# Altium project Thunderscope_Rev4.PrjPCB (part 2 of 2)

## Sheet FPGA.SchDoc: ThunderScope 1000E
size A4; DrawnBy: Aleksa Bjelogrlic; Revision: 1
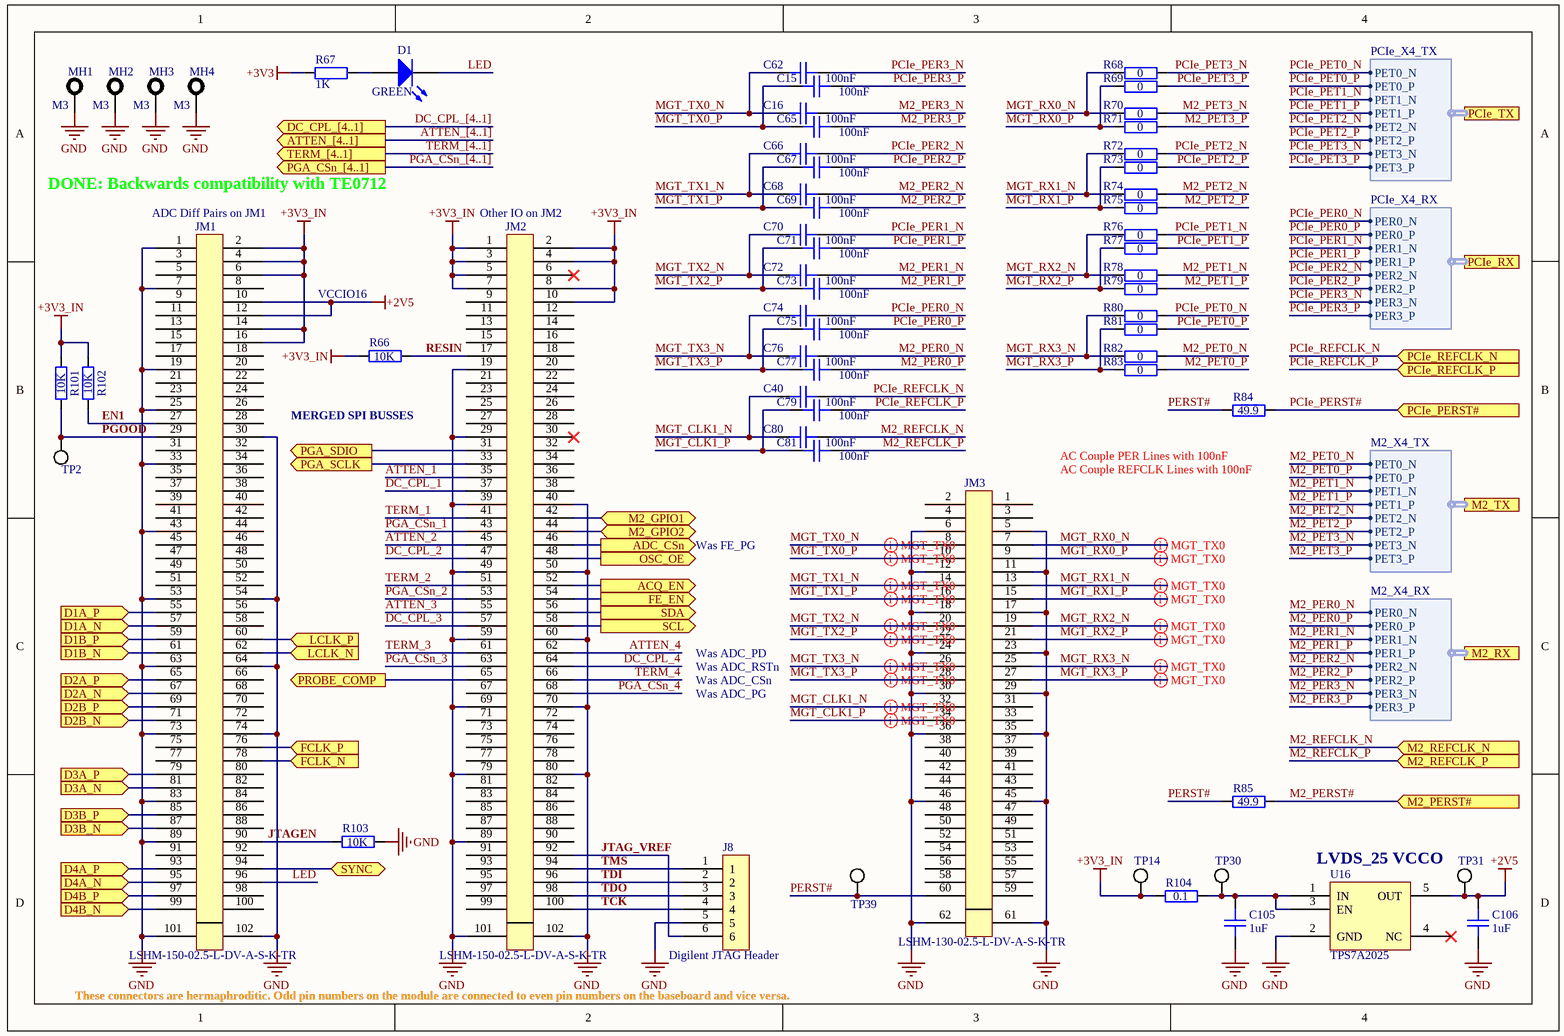
[diagram p5: FPGA.SchDoc]

### Parts
C15  100nF  [GEN_C_0201]
C16  100nF  [GEN_C_0201]
C40  100nF  [GEN_C_0201]
C62  100nF  [GEN_C_0201]
C65  100nF  [GEN_C_0201]
C66  100nF  [GEN_C_0201]
C67  100nF  [GEN_C_0201]
C68  100nF  [GEN_C_0201]
C69  100nF  [GEN_C_0201]
C70  100nF  [GEN_C_0201]
C71  100nF  [GEN_C_0201]
C72  100nF  [GEN_C_0201]
C73  100nF  [GEN_C_0201]
C74  100nF  [GEN_C_0201]
C75  100nF  [GEN_C_0201]
C76  100nF  [GEN_C_0201]
C77  100nF  [GEN_C_0201]
C79  100nF  [GEN_C_0201]
C80  100nF  [GEN_C_0201]
C81  100nF  [GEN_C_0201]
C105  1uF  [GEN_C_0402]
C106  1uF  [GEN_C_0402]
D1  GREEN  [LED_0603_LTST-S270K]
J8  2.54mm 6 Pin TH  [GEN_2.54mm_6_Pin_TH_RA]  (value not drawn)
JM1  LSHM-150-02.5-L-DV-A-S-K-TR  [SAM_LSHM-150-XX.X-XX-DV-A-S]
JM2  LSHM-150-02.5-L-DV-A-S-K-TR  [SAM_LSHM-150-XX.X-XX-DV-A-S]
JM3  LSHM-130-02.5-L-DV-A-S-K-TR  [SAM_LSHM-130-XX.X-XX-DV-A-S]
MH1  M3  [MH M3]  (no BOM)
MH2  M3  [MH M3]  (no BOM)
MH3  M3  [MH M3]  (no BOM)
MH4  M3  [MH M3]  (no BOM)
R66  10K  [GEN_R_0402]
R67  1K  [GEN_R_0402]
R68  0  [GEN_R_0201]
R69  0  [GEN_R_0201]
R70  0  [GEN_R_0201]
R71  0  [GEN_R_0201]
R72  0  [GEN_R_0201]
R73  0  [GEN_R_0201]
R74  0  [GEN_R_0201]
R75  0  [GEN_R_0201]
R76  0  [GEN_R_0201]
R77  0  [GEN_R_0201]
R78  0  [GEN_R_0201]
R79  0  [GEN_R_0201]
R80  0  [GEN_R_0201]
R81  0  [GEN_R_0201]
R82  0  [GEN_R_0201]
R83  0  [GEN_R_0201]
R84  49.9  [GEN_R_0402]
R85  49.9  [GEN_R_0402]
R101  10K  [GEN_R_0402]
R102  10K  [GEN_R_0402]
R103  10K  [GEN_R_0402]
R104  0.1  [GEN_R_0402]
TP2  PCB  [GEN_TP_PCB]  (value not drawn)  (no BOM)
TP14  PCB  [GEN_TP_PCB]  (value not drawn)  (no BOM)
TP30  PCB  [GEN_TP_PCB]  (value not drawn)  (no BOM)
TP31  PCB  [GEN_TP_PCB]  (value not drawn)  (no BOM)
TP39  PCB  [GEN_TP_PCB]  (value not drawn)  (no BOM)
U16  TPS7A2025  [GEN_SOT23_5_950_2900X1600X1450]

### Ports
ACQ_EN (out), ADC_CSn (out), ATTEN_[4..1] (out), D1A_N (in), D1A_P (in), D1B_N (in), D1B_P (in), D2A_N (in), D2A_P (in), D2B_N (in), D2B_P (in), D3A_N (in), D3A_P (in), D3B_N (in), D3B_P (in), D4A_N (in), D4A_P (in), D4B_N (in), D4B_P (in), DC_CPL_[4..1] (out), FCLK_N (in), FCLK_P (in), FE_EN (out), LCLK_N (in), LCLK_P (in), M2_GPIO1 (bidir), M2_GPIO2 (bidir), M2_PERST# (in), M2_REFCLK_N (in), M2_REFCLK_P (in), M2_RX (harness M2_X4_RX), M2_TX (harness M2_X4_TX), OSC_OE (out), PCIe_PERST# (in), PCIe_REFCLK_N (in), PCIe_REFCLK_P (in), PCIe_RX (harness PCIe_X4_RX), PCIe_TX (harness PCIe_X4_TX), PGA_CSn_[4..1] (out), PGA_SCLK (out), PGA_SDIO (out), PROBE_COMP (out), SCL (out), SDA (out), SYNC (bidir), TERM_[4..1] (out)

### Harnesses
PCIe_X4_RX: PER0_N, PER0_P, PER1_N, PER1_P, PER2_N, PER2_P, PER3_N, PER3_P
PCIe_X4_TX: PET0_N, PET0_P, PET1_N, PET1_P, PET2_N, PET2_P, PET3_N, PET3_P
M2_X4_RX: PER0_N, PER0_P, PER1_N, PER1_P, PER2_N, PER2_P, PER3_N, PER3_P
M2_X4_TX: PET0_N, PET0_P, PET1_N, PET1_P, PET2_N, PET2_P, PET3_N, PET3_P

### Nets
+2V5: C106.2 JM1.10 JM1.12 TP31.1 U16.5(OUT)
+3V3: R67.2
+3V3_IN: JM1.2 JM1.4 JM1.6 JM1.14 JM1.16 JM2.1 JM2.2 JM2.3 JM2.4 JM2.5 JM2.7 JM2.8 JM2.10 R66.2 R101.2 R102.2 R104.1 TP14.1
GND: C105.1 C106.1 J8.5 JM1.1 JM1.7 JM1.19 JM1.25 JM1.30 JM1.33 JM1.43 JM1.53 JM1.54 JM1.63 JM1.64 JM1.73 JM1.74 JM1.83 JM1.89 JM1.101 JM1.102 JM2.19 JM2.29 JM2.39 JM2.40 JM2.49 JM2.50 JM2.59 JM2.60 JM2.69 JM2.70 JM2.79 JM2.80 JM2.89 JM2.101 JM2.102 JM3.5 JM3.6 JM3.11 JM3.12 JM3.17 JM3.18 JM3.23 JM3.24 JM3.29 JM3.30 JM3.35 JM3.36 JM3.45 JM3.46 JM3.61 JM3.62 MH1.1 MH2.1 MH3.1 MH4.1 R103.1 U16.2(GND)
ACQ_EN: JM2.52 ; port ACQ_EN
ADC_CSn: JM2.46 ; port ADC_CSn
ADC_SCLK: JM2.33 ; port PGA_SCLK
ADC_SDATA: JM2.31 ; port PGA_SDIO
ATTEN_1: JM2.35
ATTEN_2: JM2.45
ATTEN_3: JM2.55
ATTEN_4: JM2.62
D1A_N: JM1.57 ; port D1A_N
D1A_P: JM1.55 ; port D1A_P
D1B_N: JM1.61 ; port D1B_N
D1B_P: JM1.59 ; port D1B_P
D2A_N: JM1.67 ; port D2A_N
D2A_P: JM1.65 ; port D2A_P
D2B_N: JM1.71 ; port D2B_N
D2B_P: JM1.69 ; port D2B_P
D3A_N: JM1.81 ; port D3A_N
D3A_P: JM1.79 ; port D3A_P
D3B_N: JM1.87 ; port D3B_N
D3B_P: JM1.85 ; port D3B_P
D4A_N: JM1.95 ; port D4A_N
D4A_P: JM1.93 ; port D4A_P
D4B_N: JM1.99 ; port D4B_N
D4B_P: JM1.97 ; port D4B_P
DC_CPL_1: JM2.37
DC_CPL_2: JM2.47
DC_CPL_3: JM2.57
DC_CPL_4: JM2.64
EN1: JM1.27 R102.1
FCLK_N: JM1.78 ; port FCLK_N
FCLK_P: JM1.76 ; port FCLK_P
FE_EN: JM2.54 ; port FE_EN
JTAG_VREF: J8.6 JM2.92
JTAGEN: JM1.90 R103.2
LCLK_N: JM1.62 ; port LCLK_N
LCLK_P: JM1.60 ; port LCLK_P
LED: D1.1(K) JM1.96
M2_GPIO1: JM2.42 ; port M2_GPIO1
M2_GPIO2: JM2.44 ; port M2_GPIO2
M2_PER0_N: C76.1 ; port M2_RX.PER0_N
M2_PER0_P: C77.1 ; port M2_RX.PER0_P
M2_PER1_N: C72.1 ; port M2_RX.PER1_N
M2_PER1_P: C73.1 ; port M2_RX.PER1_P
M2_PER2_N: C68.1 ; port M2_RX.PER2_N
M2_PER2_P: C69.1 ; port M2_RX.PER2_P
M2_PER3_N: C16.1 ; port M2_RX.PER3_N
M2_PER3_P: C65.1 ; port M2_RX.PER3_P
M2_PERST#: R85.2 ; port M2_PERST#
M2_PET0_N: R82.2 ; port M2_TX.PET0_N
M2_PET0_P: R83.2 ; port M2_TX.PET0_P
M2_PET1_N: R78.2 ; port M2_TX.PET1_N
M2_PET1_P: R79.2 ; port M2_TX.PET1_P
M2_PET2_N: R74.2 ; port M2_TX.PET2_N
M2_PET2_P: R75.2 ; port M2_TX.PET2_P
M2_PET3_N: R70.2 ; port M2_TX.PET3_N
M2_PET3_P: R71.2 ; port M2_TX.PET3_P
M2_REFCLK_N: C80.1 ; port M2_REFCLK_N
M2_REFCLK_P: C81.1 ; port M2_REFCLK_P
MGT_CLK1_N: C40.2 C80.2 JM3.32
MGT_CLK1_P: C79.2 C81.2 JM3.34
MGT_RX0_N: JM3.7 R68.1 R70.1
MGT_RX0_P: JM3.9 R69.1 R71.1
MGT_RX1_N: JM3.13 R72.1 R74.1
MGT_RX1_P: JM3.15 R73.1 R75.1
MGT_RX2_N: JM3.19 R76.1 R78.1
MGT_RX2_P: JM3.21 R77.1 R79.1
MGT_RX3_N: JM3.25 R80.1 R82.1
MGT_RX3_P: JM3.27 R81.1 R83.1
MGT_TX0_N: C16.2 C62.2 JM3.8
MGT_TX0_P: C15.2 C65.2 JM3.10
MGT_TX1_N: C66.2 C68.2 JM3.14
MGT_TX1_P: C67.2 C69.2 JM3.16
MGT_TX2_N: C70.2 C72.2 JM3.20
MGT_TX2_P: C71.2 C73.2 JM3.22
MGT_TX3_N: C74.2 C76.2 JM3.26
MGT_TX3_P: C75.2 C77.2 JM3.28
PCIe_PER0_N: C74.1 ; port PCIe_RX.PER0_N
PCIe_PER0_P: C75.1 ; port PCIe_RX.PER0_P
PCIe_PER1_N: C70.1 ; port PCIe_RX.PER1_N
PCIe_PER1_P: C71.1 ; port PCIe_RX.PER1_P
PCIe_PER2_N: C66.1 ; port PCIe_RX.PER2_N
PCIe_PER2_P: C67.1 ; port PCIe_RX.PER2_P
PCIe_PER3_N: C62.1 ; port PCIe_RX.PER3_N
PCIe_PER3_P: C15.1 ; port PCIe_RX.PER3_P
PCIe_PERST#: R84.2 ; port PCIe_PERST#
PCIe_PET0_N: R80.2 ; port PCIe_TX.PET0_N
PCIe_PET0_P: R81.2 ; port PCIe_TX.PET0_P
PCIe_PET1_N: R76.2 ; port PCIe_TX.PET1_N
PCIe_PET1_P: R77.2 ; port PCIe_TX.PET1_P
PCIe_PET2_N: R72.2 ; port PCIe_TX.PET2_N
PCIe_PET2_P: R73.2 ; port PCIe_TX.PET2_P
PCIe_PET3_N: R68.2 ; port PCIe_TX.PET3_N
PCIe_PET3_P: R69.2 ; port PCIe_TX.PET3_P
PCIe_REFCLK_N: C40.1 ; port PCIe_REFCLK_N
PCIe_REFCLK_P: C79.1 ; port PCIe_REFCLK_P
PERST#: JM3.60 R84.1 R85.1 TP39.1
PGA_CSn_1: JM2.43
PGA_CSn_2: JM2.53
PGA_CSn_3: JM2.63
PGA_CSn_4: JM2.68
PGOOD: JM1.29 R101.1 TP2.1
PLL_RSTn: JM2.48 ; port OSC_OE
PROBE_COMP: JM2.65 ; port PROBE_COMP
RESIN: JM2.17 R66.1
SCL: JM2.58 ; port SCL
SDA: JM2.56 ; port SDA
SYNC: JM1.94 ; port SYNC
TCK: J8.4 JM2.100
TDI: J8.2 JM2.96
TDO: J8.3 JM2.98
TERM_1: JM2.41
TERM_2: JM2.51
TERM_3: JM2.61
TERM_4: JM2.66
TMS: J8.1 JM2.94
NetC105_2: C105.2 R104.2 TP30.1 U16.1(IN) U16.3(EN)
NetD1_2: D1.2(A) R67.1

Not connected (* = marked no-connect by the designer): JM1 3 5 8 9 11 13 15 17 18 20 21 22 23 24 26 28 31 32 34 35 36 37 38 39 40 41 42 44 45 46 47 48 49 50 51 52 56 58 66 68 70 72 75 77 80 82 84 86 88 91 92 98 100; JM2 6* 9 11 12 13 14 15 16 18 20 21 22 23 24 25 26 27 28 30* 32 34 36 38 67 71 72 73 74 75 76 77 78 81 82 83 84 85 86 87 88 90 91 93 95 97 99; JM3 1 2 3 4 31 33 37 38 39 40 41 42 43 44 47 48 49 50 51 52 53 54 55 56 57 58 59; U16 4(NC)*

### Buses and harness runs
bus ATTEN_[4..1] = port ATTEN_[4..1]
bus DC_CPL_[4..1] = port DC_CPL_[4..1]
bus PGA_CSn_[4..1] = port PGA_CSn_[4..1]
bus TERM_[4..1] = port TERM_[4..1]

### Layout directives
differential pair; differential pair class PCIe: MGT_CLK1_N, MGT_CLK1_P, MGT_RX0_N, MGT_RX0_P, MGT_RX1_N, MGT_RX1_P, MGT_RX2_N, MGT_RX2_P, MGT_RX3_N, MGT_RX3_P, MGT_TX0_N, MGT_TX0_P, MGT_TX1_N, MGT_TX1_P, MGT_TX2_N, MGT_TX2_P, MGT_TX3_N, MGT_TX3_P

### Notes on the sheet
- DONE: Backwards compatibility with TE0712
- (near JM1) ADC Diff Pairs on JM1
- (near JM2) Other IO on JM2
- VCCIO16
- MERGED SPI BUSSES
- (near R84) AC Couple PER Lines with 100nF
- AC Couple REFCLK Lines with 100nF
- Was FE_PG
- Was ADC_PD
- Was ADC_RSTn
- Was ADC_PG
- Was ADC_CSn
- (near U16) LVDS_25 VCCO
- (near J8) Digilent JTAG Header
- These connectors are hermaphroditic. Odd pin numbers on the module are connected to even pin numbers on the baseboard and vice versa.

### Library data of the parts
C15 C16 C40 C62 C65-C77 C79-C81 = CAP 100nF 6.3V X5R 0201: Voltage Rating: 6.3V; Package: 0201; Supplier 1: Digi-Key; Supplier Part Number 1: 490-3167-1-ND; Value: 100nF
C105 C106 = CAP 1uF 25V X5R 0402: Voltage Rating: 25V; Package: 0402; Supplier 1: Digi-Key; Supplier Part Number 1: 490-10017-1-ND; Value: 1uF
D1 = LED GREEN 0603 LTST-S270K: Supplier 1: Digi-Key; Supplier Part Number 1: 160-1478-1-ND
J8 = CONN 2.54mm 6 Pin TH RA: Supplier 1: Digi-Key; Supplier Part Number 1: 732-5339-ND
JM1 JM2 = CONN LSHM-150-02.5-L-DV-A-S-K-TR: Manufacturer: Samtec; Supplier 1: Digi-Key; Supplier Part Number 1: SAM14147DKR-ND; House Part Number: LSHM-150-02.5-L-DV-A-S-K-TR; Manufacturer Part Number: LSHM-150-02.5-L-DV-A-S-K-TR
JM3 = CONN LSHM-130-02.5-L-DV-A-S-K-TR: Manufacturer: Samtec; Supplier 1: Digi-Key; Supplier Part Number 1: SAM14106DKR-ND; House Part Number: LSHM-130-02.5-L-DV-A-S-K-TR; Manufacturer Part Number: LSHM-130-02.5-L-DV-A-S-K-TR
MH1-MH4 = MH M3
R66 R101-R103 = RES 10K OHM 1% 1/10W 0402: Tolerance: 1%; Power Rating: 0.1W; Package: 0402; Supplier 1: Digi-Key; Supplier Part Number 1: P10.0KLCT-ND; Value: 10K
R67 = RES 1K OHM 1% 1/10W 0402: Tolerance: 1%; Power Rating: 0.1W; Package: 0402; Supplier 1: Digi-Key; Supplier Part Number 1: 311-1.00KLRCT-ND; Value: 1K
R68-R83 = RES 0 OHM 1% 1/20W 0201: Power Rating: 0.05W; Tolerance: 1%; Package: 0201; Supplier 1: Digi-Key; Supplier Part Number 1: RMCF0201ZT0R00CT-ND; Value: 0
R84 R85 = RES 49.9 OHM 1% 1/10W 0402: Tolerance: 1%; Power Rating: 0.1W; Package: 0402; Supplier 1: Digi-Key; Supplier Part Number 1: 311-49.9LRCT-ND; Value: 49.9
R104 = RES 0.1 OHM 1% 1/6W 0402: Tolerance: 1%; Power Rating: 0.16W; Package: 0402; Supplier 1: Digi-Key; Supplier Part Number 1: P.10AKCT-ND; Value: 0.1
TP2 TP14 TP30 TP31 TP39 = TP PCB 1mm
U16 = IC LDO TPS7A2025: Supplier 1: Digi-Key; Supplier Part Number 1: 296-TPS7A2025PDBVRCT-ND

## Sheet CON_PCIe_X4.SchDoc: ThunderScope 1000E
size A4; DrawnBy: Aleksa Bjelogrlic; Revision: 1
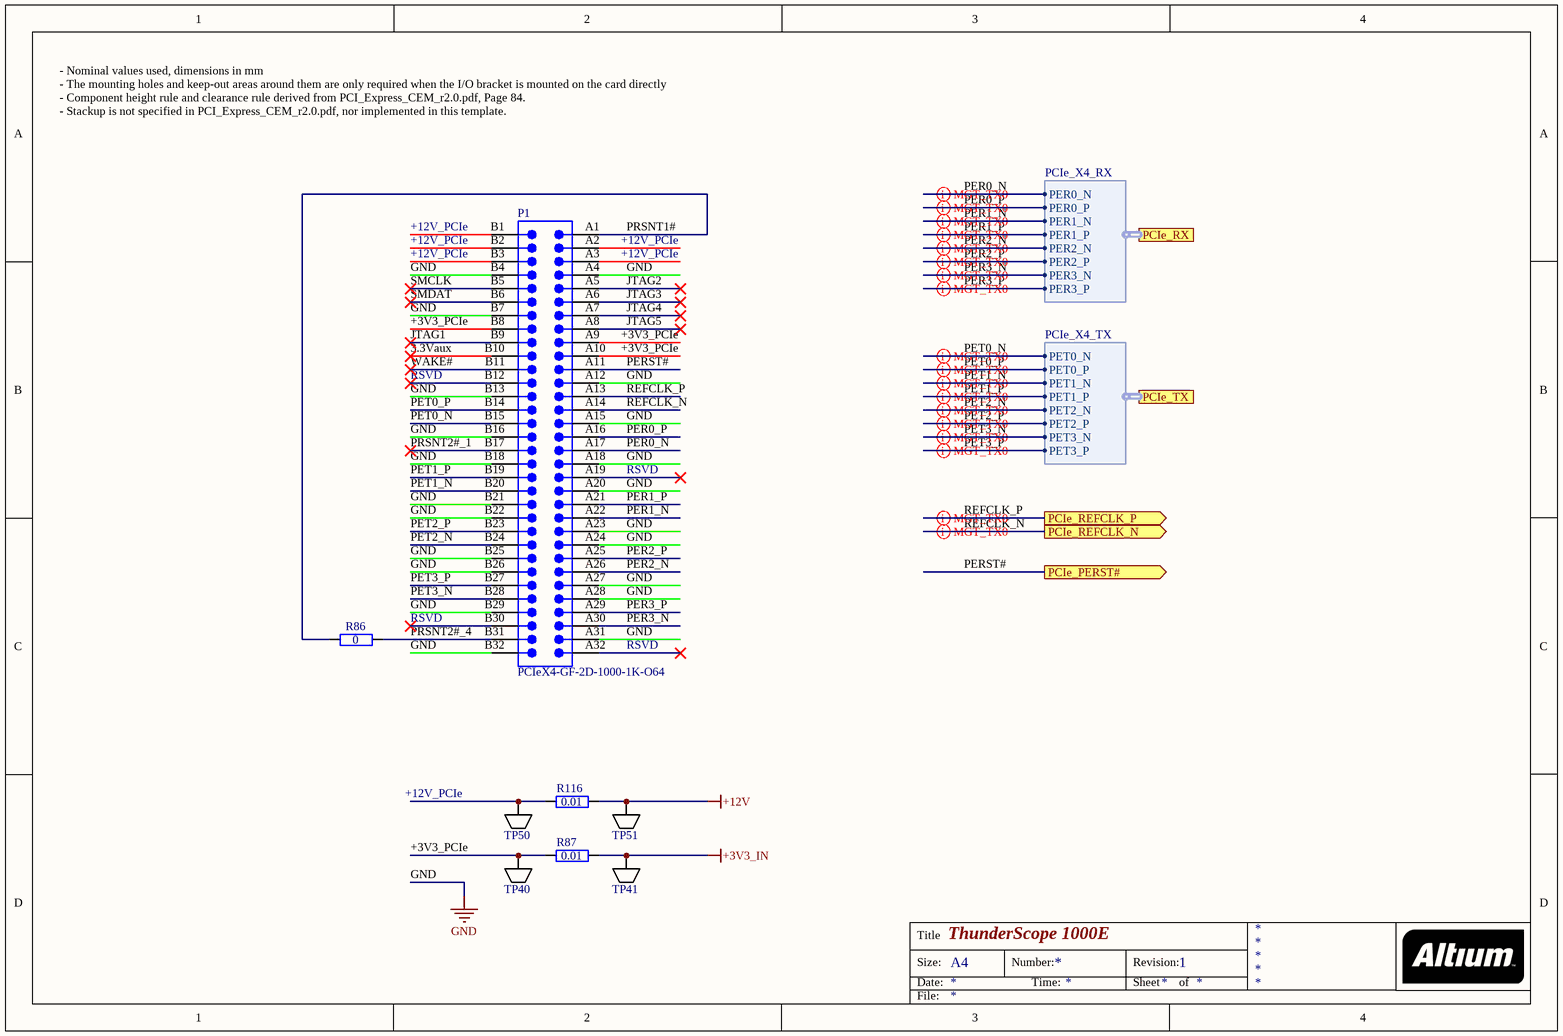
[diagram p6: CON_PCIe_X4.SchDoc]

### Parts
P1  PCIeX4-GF-2D-1000-1K-O64  [PCIeX4-GF-2D-1000-1K-O64]  (no BOM)
R86  0  [GEN_R_0402]
R87  0.01  [GEN_R_0603]
R116  0.01  [GEN_R_0603]
TP40  5015  [KEY_5015]  (value not drawn)
TP41  5015  [KEY_5015]  (value not drawn)
TP50  5015  [KEY_5015]  (value not drawn)
TP51  5015  [KEY_5015]  (value not drawn)

### Ports
PCIe_PERST# (out), PCIe_REFCLK_N (out), PCIe_REFCLK_P (out), PCIe_RX (harness PCIe_X4_RX), PCIe_TX (harness PCIe_X4_TX)

### Harnesses
PCIe_X4_RX: PER0_N, PER0_P, PER1_N, PER1_P, PER2_N, PER2_P, PER3_N, PER3_P
PCIe_X4_TX: PET0_N, PET0_P, PET1_N, PET1_P, PET2_N, PET2_P, PET3_N, PET3_P

### Nets
+3V3_IN: R87.2 TP41.1
+12V: R116.2 TP51.1
GND: P1.A4 P1.A12 P1.A15 P1.A18 P1.A20 P1.A23 P1.A24 P1.A27 P1.A28 P1.A31 P1.B4 P1.B7 P1.B13 P1.B16 P1.B18 P1.B21 P1.B22 P1.B25 P1.B26 P1.B29 P1.B32
3.3Vaux: P1.B10
+3V3_PCIe: P1.A9 P1.A10 P1.B8 R87.1 TP40.1
+12V_PCIe: P1.A2 P1.A3 P1.B1 P1.B2 P1.B3 R116.1 TP50.1
JTAG1: P1.B9
JTAG2: P1.A5
JTAG3: P1.A6
JTAG4: P1.A7
JTAG5: P1.A8
PER0_N: P1.A17 ; port PCIe_RX.PER0_N  [project net PCIe_PER0_N]
PER0_P: P1.A16 ; port PCIe_RX.PER0_P  [project net PCIe_PER0_P]
PER1_N: P1.A22 ; port PCIe_RX.PER1_N  [project net PCIe_PER1_N]
PER1_P: P1.A21 ; port PCIe_RX.PER1_P  [project net PCIe_PER1_P]
PER2_N: P1.A26 ; port PCIe_RX.PER2_N  [project net PCIe_PER2_N]
PER2_P: P1.A25 ; port PCIe_RX.PER2_P  [project net PCIe_PER2_P]
PER3_N: P1.A30 ; port PCIe_RX.PER3_N  [project net PCIe_PER3_N]
PER3_P: P1.A29 ; port PCIe_RX.PER3_P  [project net PCIe_PER3_P]
PERST#: P1.A11 ; port PCIe_PERST#  [project net PCIe_PERST#]
PET0_N: P1.B15 ; port PCIe_TX.PET0_N  [project net PCIe_PET0_N]
PET0_P: P1.B14 ; port PCIe_TX.PET0_P  [project net PCIe_PET0_P]
PET1_N: P1.B20 ; port PCIe_TX.PET1_N  [project net PCIe_PET1_N]
PET1_P: P1.B19 ; port PCIe_TX.PET1_P  [project net PCIe_PET1_P]
PET2_N: P1.B24 ; port PCIe_TX.PET2_N  [project net PCIe_PET2_N]
PET2_P: P1.B23 ; port PCIe_TX.PET2_P  [project net PCIe_PET2_P]
PET3_N: P1.B28 ; port PCIe_TX.PET3_N  [project net PCIe_PET3_N]
PET3_P: P1.B27 ; port PCIe_TX.PET3_P  [project net PCIe_PET3_P]
PRSNT1#: P1.A1 R86.1
PRSNT2#_1: P1.B17
PRSNT2#_4: P1.B31 R86.2
REFCLK_N: P1.A14 ; port PCIe_REFCLK_N  [project net PCIe_REFCLK_N]
REFCLK_P: P1.A13 ; port PCIe_REFCLK_P  [project net PCIe_REFCLK_P]
SMCLK: P1.B5
SMDAT: P1.B6
WAKE#: P1.B11

Not connected (* = marked no-connect by the designer): P1 A19* A32* B12* B30*

### Layout directives
differential pair; differential pair class PCIe: PCIe_PER0_N, PCIe_PER0_P, PCIe_PER1_N, PCIe_PER1_P, PCIe_PER2_N, PCIe_PER2_P, PCIe_PER3_N, PCIe_PER3_P, PCIe_PET0_N, PCIe_PET0_P, PCIe_PET1_N, PCIe_PET1_P, PCIe_PET2_N, PCIe_PET2_P, PCIe_PET3_N, PCIe_PET3_P, PCIe_REFCLK_N, PCIe_REFCLK_P

### Notes on the sheet
- - Nominal values used, dimensions in mm
  - The mounting holes and keep-out areas around them are only required when the I/O bracket is mounted on the card directly
  - Component height rule and clearance rule derived from PCI_Express_CEM_r2.0.pdf, Page 84.
  - Stackup is not specified in PCI_Express_CEM_r2.0.pdf, nor implemented in this template.
- RSVD
- (near R86) RSVD
- Title
- Size:
- Date:
- A4
- Number:
- Time:
- Revision:
- Sheet
- of
- File:

### Library data of the parts
P1 = CMP-0001-00031-2: Golden finger, PCIeX4, Dual, Opposite, Pitch 1mm, 64-Position; Mating Connector: Molex-87715-9106; Datasheet Version: rev2.0, Apr-2007; Package Reference: PCIeX4-GF-2D-1000-1K-O64; ClassName: Edge Connector; Publisher: Altium
R86 = RES 0 OHM 1/16W 0402: Power Rating: 0.0625W; Package: 0402; Supplier 1: Digi-Key; Supplier Part Number 1: 311-0.0JRCT-ND; Value: 0
R87 R116 = RES 0.01 OHM 1% 1/4W 0603: Tolerance: 1%; Power Rating: 0.25W; Supplier 1: Digi-Key; Supplier Part Number 1: 408-1404-1-ND; Value: 0.01; Package: 0603
TP40 TP41 TP50 TP51 = TP KEYSTONE 5015: Supplier 1: Digi-Key; Supplier Part Number 1: 36-5015CT-ND

## Sheet PWR.SchDoc: ThunderScope 1000E
size A4
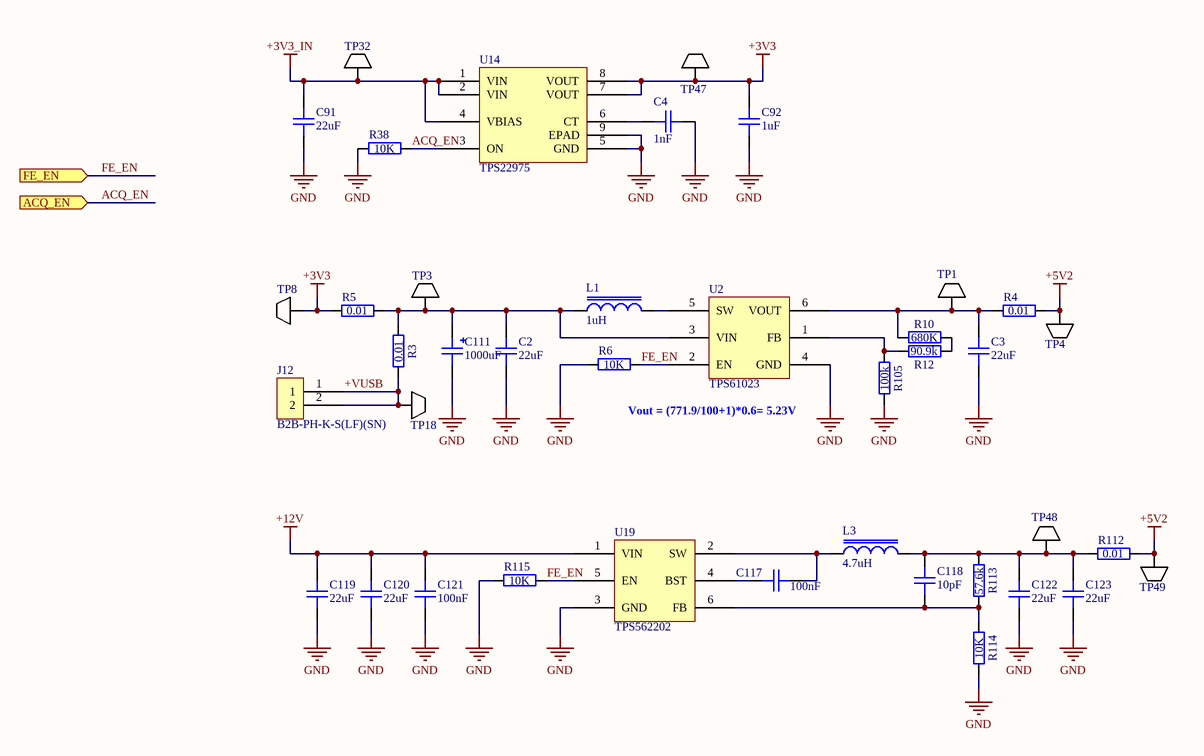
[diagram p7: PWR.SchDoc]

### Parts
C2  22uF  [GEN_C_0805]
C3  22uF  [GEN_C_0805]
C4  1nF  [GEN_C_0402]
C91  22uF  [GEN_C_0805]
C92  1uF  [GEN_C_0402]
C111  1000uF  [GEN_C_POLAR_10mm]
C117  100nF  [GEN_C_0402]
C118  10pF  [GEN_C_0402]
C119  22uF  [GEN_C_0805]
C120  22uF  [GEN_C_0805]
C121  100nF  [GEN_C_0402]
C122  22uF  [GEN_C_0805]
C123  22uF  [GEN_C_0805]
J12  B2B-PH-K-S(LF)(SN)  [JST_B2B-PH-K-S(LF)(SN)]
L1  1uH  [GEN_L_1210]
L3  4.7uH  [TY_IND_NRS5030]
R3  0.01  [GEN_R_0603]
R4  0.01  [GEN_R_0603]
R5  0.01  [GEN_R_0603]
R6  10K  [GEN_R_0402]
R10  680K  [GEN_R_0402]
R12  90.9k  [GEN_R_0402]
R38  10K  [GEN_R_0402]
R105  100k  [GEN_R_0402]
R112  0.01  [GEN_R_0603]
R113  57.6k  [GEN_R_0402]
R114  10K  [GEN_R_0402]
R115  10K  [GEN_R_0402]
TP1  5015  [KEY_5015]  (value not drawn)
TP3  5015  [KEY_5015]  (value not drawn)
TP4  5015  [KEY_5015]  (value not drawn)
TP8  5015  [KEY_5015]  (value not drawn)
TP18  5015  [KEY_5015]  (value not drawn)
TP32  5015  [KEY_5015]  (value not drawn)
TP47  5015  [KEY_5015]  (value not drawn)
TP48  5015  [KEY_5015]  (value not drawn)
TP49  5015  [KEY_5015]  (value not drawn)
U2  TPS61023  [TI_SOT563_DRL0006A]
U14  TPS22975  [TI_WSON8_DSG0008A]
U19  TPS562202  [TI_SOT563_DRL0006A]

### Ports
ACQ_EN (in), FE_EN (in)

### Nets
+3V3: C92.2 R5.2 TP8.1 TP47.1 U14.7(VOUT) U14.8(VOUT)
+3V3_IN: C91.2 TP32.1 U14.1(VIN) U14.2(VIN) U14.4(VBIAS)
+5V2: R4.2 R112.2 TP4.1 TP49.1
+12V: C119.2 C120.2 C121.1 U19.1(VIN)
GND: C2.1 C3.1 C4.1 C91.1 C92.1 C111.2 C119.1 C120.1 C121.2 C122.1 C123.1 R6.2 R38.1 R105.1 R114.1 R115.2 U2.4(GND) U14.5(GND) U14.9(EPAD) U19.3(GND)
+VUSB: J12.1 J12.2 R3.2 TP18.1
ACQ_EN: R38.2 U14.3(ON) ; port ACQ_EN
FE_EN: R6.1 R115.1 U2.2(EN) U19.5(EN) ; port FE_EN
NetC2_2: C2.2 C111.1 L1.1 R3.1 R5.1 TP3.1 U2.3(VIN)
NetC3_2: C3.2 R4.1 R10.2 TP1.1 U2.6(VOUT)
NetC4_2: C4.2 U14.6(CT)
NetC117_1: C117.1 L3.1 U19.2(SW)
NetC117_2: C117.2 U19.4(BST)
NetC118_1: C118.1 R113.1 R114.2 U19.6(FB)
NetC118_2: C118.2 C122.2 C123.2 L3.2 R112.1 R113.2 TP48.1
NetL1_2: L1.2 U2.5(SW)
NetR10_1: R10.1 R12.2
NetR12_1: R12.1 R105.2 U2.1(FB)

### Notes on the sheet
- Vout = (771.9/100+1)*0.6= 5.23V

### Library data of the parts
C2 C3 C91 C119 C120 C122 C123 = CAP 22uF 25V X5R 0805: Voltage Rating: 25V; Package: 0805; Value: 22uF; Supplier 1: Digi-Key; Supplier Part Number 1: 490-10749-1-ND
C4 = CAP 1nF 50V C0G 0402: Voltage Rating: 50V; Package: 0402; Supplier 1: Digi-Key; Supplier Part Number 1: 490-6189-1-ND; Value: 1nF
C92 = CAP 1uF 25V X5R 0402: Voltage Rating: 25V; Package: 0402; Value: 1uF; Supplier 1: Digi-Key; Supplier Part Number 1: 490-10017-1-ND
C111 = CAP 1000uF 16V 10mm Dia: Voltage Rating: 16V; Package: 10mm; Value: 1000uF; Supplier 1: Digi-Key; Supplier Part Number 1: P124991CT-ND
C117 C121 = CAP 100nF 16V X7R 0402: Voltage Rating: 16V; Package: 0402; Supplier 1: Digi-Key; Supplier Part Number 1: 490-4759-1-ND; Value: 100nF
C118 = CAP 10pF 50V C0G 0402: Temperature Coefficient: C0G; Voltage Rating: 50V; Package: 0402; Value: 10pF; Supplier 1: Digi-Key; Supplier Part Number 1: 1276-1139-1-ND
J12 = CONN JST PH 2 Pin TH: Supplier 1: Digi-Key; Supplier Part Number 1: 455-1704-ND
L1 = IND 1uH 3.1A 45 MOHM 1210: Value: 1uH; Supplier 1: Digi-Key; Supplier Part Number 1: 490-10590-1-ND
L3 = IND 4.7uH 2.6A 35 MOHM SMD: Value: 4.7uH; Supplier 1: Digi-Key; Supplier Part Number 1: 587-3461-1-ND
R3-R5 R112 = RES 0.01 OHM 1% 1/4W 0603: Tolerance: 1%; Power Rating: 0.25W; Supplier 1: Digi-Key; Supplier Part Number 1: 408-1404-1-ND; Value: 0.01; Package: 0603
R6 R38 R114 R115 = RES 10K OHM 1% 1/10W 0402: Tolerance: 1%; Power Rating: 0.1W; Package: 0402; Supplier 1: Digi-Key; Supplier Part Number 1: P10.0KLCT-ND; Value: 10K
R10 = RES 680K OHM 1% 1/16W 0402: Manufacturer: Yageo; Manufacturer Part Number: RC0402FR-07681KL; Tolerance: 1%; Package: 0402; Supplier 1: Digi-Key; Supplier Part Number 1: YAG3211CT-ND; Value: 680K
R12 = RES 90.9K OHM 1% 1/16W 0402: Tolerance: 1%; Power Rating: 0.0625W; Package: 0402; Supplier 1: Digi-Key; Supplier Part Number 1: 311-90.9KLRCT-ND; Value: 90.9k
R105 = RES 100K OHM 1% 1/10W 0402: Tolerance: 1%; Power Rating: 0.1W; Package: 0402; Supplier 1: Digi-Key; Supplier Part Number 1: 311-100KLRCT-ND; Value: 100k
R113 = RES 57.6K OHM 1% 1/16W 0402: Tolerance: 1%; Power Rating: 0.0625W; Package: 0402; Value: 57.6k; Supplier 1: Digi-Key; Supplier Part Number 1: YAG3190CT-ND
TP1 TP3 TP4 TP8 TP18 TP32 TP47-TP49 = TP KEYSTONE 5015: Supplier 1: Digi-Key; Supplier Part Number 1: 36-5015CT-ND
U2 = IC BOOST TPS61023: Supplier 1: Digi-Key; Supplier Part Number 1: 296-TPS61023DRLTCT-ND
U14 = IC SWITCH LOAD TPS22975: Supplier 1: Digi-Key; Supplier Part Number 1: 296-47228-1-ND
U19 = IC BUCK TPS562202: Supplier 1: Digi-Key; Supplier Part Number 1: 296-TPS562202DRLRCT-ND

## Nets that join several sheets
+1V8APLL: ADC (FB3.2), PLL (21 pins)
+3V3: Main (C1.1 R110.1 U1.5), FE (Q1.2 Q2.2 R20.2 R21.2), Front End/CH1 (D1000A.1 D1001A.1 K1000A.1 K1001A.1), Front End/CH2 (D1000B.1 D1001B.1 K1000B.1 K1001B.1), Front End/CH3 (D1000C.1 D1001C.1 K1000C.1 K1001C.1), Front End/CH4 (D1000D.1 D1001D.1 K1000D.1 K1001D.1), ADC (9 pins), PLL (FB5.1 R89.2 R90.2 R91.2), FPGA (R67.2), PWR (6 pins)
+3V3_IN: FPGA (18 pins), CON_PCIe_X4 (R87.2 TP41.1), PWR (5 pins)
+3V3_PGA: FE (C126.2 TP53.1 U20.5), Front End/CH1 (C26A.2 R29A.2 U7A.12), Front End/CH2 (C26B.2 R29B.2 U7B.12), Front End/CH3 (C26C.2 R29C.2 U7C.12), Front End/CH4 (C26D.2 R29D.2 U7D.12)
+5V: FE (18 pins), Front End/CH1 (19 pins), Front End/CH2 (19 pins), Front End/CH3 (19 pins), Front End/CH4 (19 pins)
+5V2: FE (R7.1 R8.1 TP13.1), PWR (R4.2 R112.2 TP4.1 TP49.1)
+12V: CON_PCIe_X4 (R116.2 TP51.1), PWR (C119.2 C120.2 C121.1 U19.1)
+VBIAS: FE (TP17.1 U8.2 U8.6), Front End/CH1 (R97A.2 R98A.1), Front End/CH2 (R97B.2 R98B.1), Front End/CH3 (R97C.2 R98C.1), Front End/CH4 (R97D.2 R98D.1)
-5V: FE (7 pins), Front End/CH1 (14 pins), Front End/CH2 (14 pins), Front End/CH3 (14 pins), Front End/CH4 (14 pins)
-VBIAS: FE (TP19.1 U5.2 U5.6), Front End/CH1 (C1030A.1 R1051A.1), Front End/CH2 (C1030B.1 R1051B.1), Front End/CH3 (C1030C.1 R1051C.1), Front End/CH4 (C1030D.1 R1051D.1)
GND: Main (20 pins), FE (29 pins), Front End/CH1 (47 pins), Front End/CH2 (47 pins), Front End/CH3 (47 pins), Front End/CH4 (47 pins), ADC (34 pins), PLL (27 pins), FPGA (57 pins), CON_PCIe_X4 (21 pins), PWR (20 pins)
ACQ_EN: Main (TP33.1), FPGA (JM2.52), PWR (R38.2 U14.3)
ADC_CLK_N: ADC (C104.2 J5.1), PLL (U15.48)
ADC_CLK_P: ADC (C103.2 J6.1), PLL (U15.47)
ADC_CSn: ADC (R42.1 TP29.1 U12.2), FPGA (JM2.46)
ADC_SCLK: Front End/CH1 (U7A.11), Front End/CH2 (U7B.11), Front End/CH3 (U7C.11), Front End/CH4 (U7D.11), ADC (TP35.1 U12.4), FPGA (JM2.33)
ADC_SDATA: Front End/CH1 (U7A.10), Front End/CH2 (U7B.10), Front End/CH3 (U7C.10), Front End/CH4 (U7D.10), ADC (TP34.1 U12.3), FPGA (JM2.31)
ATTEN_1: Front End/CH1 (R1038A.2 R1040A.2 TP1018A.1), FPGA (JM2.35)
ATTEN_2: Front End/CH2 (R1038B.2 R1040B.2 TP1018B.1), FPGA (JM2.45)
ATTEN_3: Front End/CH3 (R1038C.2 R1040C.2 TP1018C.1), FPGA (JM2.55)
ATTEN_4: Front End/CH4 (R1038D.2 R1040D.2 TP1018D.1), FPGA (JM2.62)
CH1_N: Front End/CH1 (R40A.2), ADC (R57.2 U12.47)
CH1_P: Front End/CH1 (R30A.2), ADC (R57.1 U12.46)
CH2_N: Front End/CH2 (R40B.2), ADC (R60.2 U12.44)
CH2_P: Front End/CH2 (R30B.2), ADC (R60.1 U12.43)
CH3_N: Front End/CH3 (R40C.2), ADC (R62.2 U12.41)
CH3_P: Front End/CH3 (R30C.2), ADC (R62.1 U12.40)
CH4_N: Front End/CH4 (R40D.2), ADC (R63.2 U12.38)
CH4_P: Front End/CH4 (R30D.2), ADC (R63.1 U12.37)
D1A_N: ADC (U12.10), FPGA (JM1.57)
D1A_P: ADC (U12.9), FPGA (JM1.55)
D1B_N: ADC (U12.12), FPGA (JM1.61)
D1B_P: ADC (U12.11), FPGA (JM1.59)
D2A_N: ADC (U12.14), FPGA (JM1.67)
D2A_P: ADC (U12.13), FPGA (JM1.65)
D2B_N: ADC (U12.16), FPGA (JM1.71)
D2B_P: ADC (U12.15), FPGA (JM1.69)
D3A_N: ADC (U12.22), FPGA (JM1.81)
D3A_P: ADC (U12.21), FPGA (JM1.79)
D3B_N: ADC (U12.24), FPGA (JM1.87)
D3B_P: ADC (U12.23), FPGA (JM1.85)
D4A_N: ADC (U12.26), FPGA (JM1.95)
D4A_P: ADC (U12.25), FPGA (JM1.93)
D4B_N: ADC (U12.28), FPGA (JM1.99)
D4B_P: ADC (U12.27), FPGA (JM1.97)
DC_CPL_1: Front End/CH1 (R1061A.2 R1062A.2 TP1022A.1), FPGA (JM2.37)
DC_CPL_2: Front End/CH2 (R1061B.2 R1062B.2 TP1022B.1), FPGA (JM2.47)
DC_CPL_3: Front End/CH3 (R1061C.2 R1062C.2 TP1022C.1), FPGA (JM2.57)
DC_CPL_4: Front End/CH4 (R1061D.2 R1062D.2 TP1022D.1), FPGA (JM2.64)
FCLK_N: ADC (U12.20), FPGA (JM1.78)
FCLK_P: ADC (U12.19), FPGA (JM1.76)
FE_EN: Main (TP7.1), FPGA (JM2.54), PWR (R6.1 R115.1 U2.2 U19.5)
LCLK_N: ADC (U12.18), FPGA (JM1.62)
LCLK_P: ADC (U12.17), FPGA (JM1.60)
PCIe_PER0_N: FPGA (C74.1), CON_PCIe_X4 (P1.A17)
PCIe_PER0_P: FPGA (C75.1), CON_PCIe_X4 (P1.A16)
PCIe_PER1_N: FPGA (C70.1), CON_PCIe_X4 (P1.A22)
PCIe_PER1_P: FPGA (C71.1), CON_PCIe_X4 (P1.A21)
PCIe_PER2_N: FPGA (C66.1), CON_PCIe_X4 (P1.A26)
PCIe_PER2_P: FPGA (C67.1), CON_PCIe_X4 (P1.A25)
PCIe_PER3_N: FPGA (C62.1), CON_PCIe_X4 (P1.A30)
PCIe_PER3_P: FPGA (C15.1), CON_PCIe_X4 (P1.A29)
PCIe_PERST#: FPGA (R84.2), CON_PCIe_X4 (P1.A11)
PCIe_PET0_N: FPGA (R80.2), CON_PCIe_X4 (P1.B15)
PCIe_PET0_P: FPGA (R81.2), CON_PCIe_X4 (P1.B14)
PCIe_PET1_N: FPGA (R76.2), CON_PCIe_X4 (P1.B20)
PCIe_PET1_P: FPGA (R77.2), CON_PCIe_X4 (P1.B19)
PCIe_PET2_N: FPGA (R72.2), CON_PCIe_X4 (P1.B24)
PCIe_PET2_P: FPGA (R73.2), CON_PCIe_X4 (P1.B23)
PCIe_PET3_N: FPGA (R68.2), CON_PCIe_X4 (P1.B28)
PCIe_PET3_P: FPGA (R69.2), CON_PCIe_X4 (P1.B27)
PCIe_REFCLK_N: FPGA (C40.1), CON_PCIe_X4 (P1.A14)
PCIe_REFCLK_P: FPGA (C79.1), CON_PCIe_X4 (P1.A13)
PGA_CSn_1: Front End/CH1 (R29A.1 TP26A.1 U7A.9), FPGA (JM2.43)
PGA_CSn_2: Front End/CH2 (R29B.1 TP26B.1 U7B.9), FPGA (JM2.53)
PGA_CSn_3: Front End/CH3 (R29C.1 TP26C.1 U7C.9), FPGA (JM2.63)
PGA_CSn_4: Front End/CH4 (R29D.1 TP26D.1 U7D.9), FPGA (JM2.68)
PLL_RSTn: PLL (R28.2 R89.1 TP44.1), FPGA (JM2.48)
PROBE_COMP: Main (R2.2 U1.2), FPGA (JM2.65)
REFINOUT: Main (R106.2 R107.2), PLL (C96.2 R88.2)
SCL: FE (Q2.3 R21.1), PLL (R90.1 TP43.1 U15.24), FPGA (JM2.58)
SDA: FE (Q1.3 R20.1), PLL (R91.1 TP42.1 U15.25), FPGA (JM2.56)
SYNC: Main (R108.2 R109.2 R110.2), FPGA (JM1.94)
TERM_1: Front End/CH1 (R1039A.2 R1041A.2 TP1019A.1), FPGA (JM2.41)
TERM_2: Front End/CH2 (R1039B.2 R1041B.2 TP1019B.1), FPGA (JM2.51)
TERM_3: Front End/CH3 (R1039C.2 R1041C.2 TP1019C.1), FPGA (JM2.61)
TERM_4: Front End/CH4 (R1039D.2 R1041D.2 TP1019D.1), FPGA (JM2.66)
TRIM1: FE (R15.1 U17.1), Front End/CH1 (5 pins)
TRIM2: FE (R17.1 U17.8), Front End/CH2 (5 pins)
TRIM3: FE (R18.1 U17.9), Front End/CH3 (5 pins)
TRIM4: FE (R19.1 U17.14), Front End/CH4 (5 pins)
VCM: FE (TP16.1), Front End/CH1 (U7A.13), Front End/CH2 (U7B.13), Front End/CH3 (U7C.13), Front End/CH4 (U7D.13), ADC (U12.48)

## Assembly variants
PCIe: not fitted C16 C65 C68 C69 C72 C73 C76 C77 C80 C81 C108 C109 C110 D4 D5 FB7 J7 J9 J10 J12 R3 R15 R17 R18 R19 R51A R51B R51C R51D R54A R54B R54C R54D R70 R71 R74 R75 R78 R79 R82 R83 R85 R95 R106 R108 U18
TB: not fitted C15 C40 C62 C66 C67 C70 C71 C74 C75 C79 C108 C109 C110 D6 D7 FB7 J11 R5 R15 R17 R18 R19 R51A R51B R51C R51D R54A R54B R54C R54D R68 R69 R72 R73 R76 R77 R80 R81 R84 R86 R87 R107 R109 SHLD1 U18